# Altium schematic sheet SFP_uptoSFP28.SchDoc
size A3
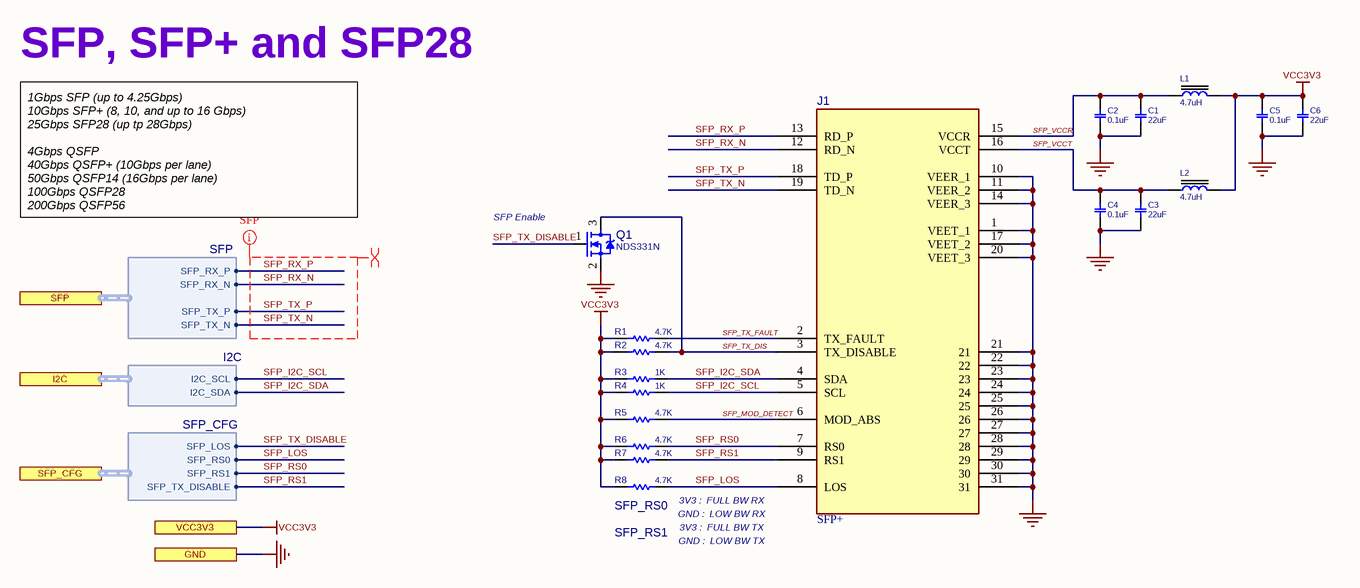
[diagram p0: SFP_uptoSFP28.SchDoc]

## Parts
C1  22uF  [C0603]
C2  0.1uF  [C0402]
C3  22uF  [C0603]
C4  0.1uF  [C0402]
C5  0.1uF  [C0402]
C6  22uF  [C0603]
J1  SFP+  [SFP_20_SH]
L1  4.7uH  [L_3]
L2  4.7uH  [L_3]
Q1  NDS331N  [SOT23_3]
R1  4.7K  [R0402]
R2  4.7K  [R0402]
R3  1K  [R0402]
R4  1K  [R0402]
R5  4.7K  [R0402]
R6  4.7K  [R0402]
R7  4.7K  [R0402]
R8  4.7K  [R0402]

## Ports
GND, I2C (harness I2C), SFP (harness SFP), SFP_CFG (harness SFP_CFG), VCC3V3

## Harnesses
SFP: SFP_RX_N, SFP_RX_P, SFP_TX_N, SFP_TX_P
I2C: I2C_SCL, I2C_SDA
SFP_CFG: SFP_LOS, SFP_RS0, SFP_RS1, SFP_TX_DISABLE

## Nets
GND: C1.2 C2.2 C3.2 C4.1 C5.1 C6.2 J1.1(VEET_1) J1.10(VEER_1) J1.11(VEER_2) J1.14(VEER_3) J1.17(VEET_2) J1.20(VEET_3) J1.21 J1.22 J1.23 J1.24 J1.25 J1.26 J1.27 J1.28 J1.29 J1.30 J1.31 Q1.2(SOURCE) ; port GND
VCC3V3: C5.2 C6.1 L1.2 L2.2 R1.2 R2.2 R3.1 R4.1 R5.2 R6.2 R7.2 R8.2 ; port VCC3V3
SFP_I2C_SCL: J1.5(SCL) R4.2 ; port I2C.I2C_SCL
SFP_I2C_SDA: J1.4(SDA) R3.2 ; port I2C.I2C_SDA
SFP_LOS: J1.8(LOS) R8.1 ; port SFP_CFG.SFP_RS0
SFP_MOD_DETECT: J1.6(MOD_ABS) R5.1
SFP_RS0: J1.7(RS0) R6.1 ; port SFP_CFG.SFP_RS1
SFP_RS1: J1.9(RS1) R7.1 ; port SFP_CFG.SFP_TX_DISABLE
SFP_RX_N: J1.12(RD_N) ; port SFP.SFP_RX_N
SFP_RX_P: J1.13(RD_P) ; port SFP.SFP_RX_P
SFP_TX_DIS: J1.3(TX_DISABLE) Q1.3(DRAIN) R2.1
SFP_TX_DISABLE: Q1.1(GATE) ; port SFP_CFG.SFP_LOS
SFP_TX_FAULT: J1.2(TX_FAULT) R1.1
SFP_TX_N: J1.19(TD_N) ; port SFP.SFP_TX_N
SFP_TX_P: J1.18(TD_P) ; port SFP.SFP_TX_P
SFP_VCCR: C1.1 C2.1 J1.15(VCCR) L1.1
SFP_VCCT: C3.1 C4.2 J1.16(VCCT) L2.1

## Layout directives
differential pair: SFP_RX_N, SFP_RX_P, SFP_TX_N, SFP_TX_P
net class SFP: SFP_RX_N, SFP_RX_P, SFP_TX_N, SFP_TX_P

## Notes on the sheet
- SFP, SFP+ and SFP28
- 1Gbps SFP (up to 4.25Gbps)
  10Gbps SFP+ (8, 10, and up to 16 Gbps)
  25Gbps SFP28 (up tp 28Gbps)
  4Gbps QSFP
  40Gbps QSFP+ (10Gbps per lane)
  50Gbps QSFP14 (16Gbps per lane)
  100Gbps QSFP28
  200Gbps QSFP56
- (near Q1) SFP Enable
- 3V3 :  FULL BW RX
- (near R8) SFP_RS0
- (near R8) SFP_RS1
- GND :  LOW BW RX
- GND :  LOW BW TX
- 3V3 :  FULL BW TX
- Title
- Size:
- Date:
- A3
- Number:
- Time:
- Revision:
- Sheet
- of
- File:

## Library data of the parts
C1 C3 C6 = CAP_SMD_MLCC_100u6.3VT: CAP, MLCC, X5R 22uF 20% 25V; MANF_P#: JMK325BJ107MM-T; MANF: Taiyo Yuden; PARAM: X5R, 20%, -55~85oC; PARAM2: 25v; PRICE: 100= 45$; VALUE: 22uF
C2 C4 C5 = CAP_SMD_MLCC_100n50T: CAP, MLCC, 100nF, 50V, X7R, 10%, 0402C; MANF: Taiyo Yuden; MANF_P#: UMK105B7104KVHF; PARAM: 50V; DESC: CAP, MLCC, 100nF, 50V, X7R, 10%, 0402C; PARAM2: X7R, 10%; ASSEMBLY: ASSEMBLY; PRICE: 100= 5$; VALUE: 0.1uF
J1 = CONN_SFP_20_SH: CONN, SFP PLUS (SFP+) RCPT 20POS R/A GOLD SMD; MANF: Molex; MANF_P#: 74441-0010; PARAM: optic fiber, SFP+; PRICE: 5.7$; VALUE: SFP+
L1 L2 = IND_SMD_2.2uH_2.9A: INDUCTOR; PARAM: 9.6A, 8.7A (Isat); MANF_P#: XAL4020-102MEC; MANF: Coilcraft; PARAM2: 14.6mOhm, -40~125oC; PRICE: 1.8$; ASSEMBLY: ASSEMBLY; VALUE: 4.7uH
Q1 = MOSN_NDS331N_SOT23: MOSFET N-CH 20V 1.3A 3-SSOT; DESC: DESCRIPTION; PARAM2: 460MW; MANF: Fairchild; PRICE: 0.072; PARAM: 20V; ASSEMBLY: ASSEMBLY; MANF_P#: NDS331N; VALUE: NDS331N
R1 R2 R5-R8 = RES_SMD_10K_0402: RESISTOR, SMD; MANF: Yageo; PARAM: 0.063W; DESC: DESCRIPTION; DIST#: MOUSER; PARAM2: 1%; MANF_P#: RC0402FR-074K7L; ASSEMBLY: ASSEMBLY; PRICE: 100= 0.3$; VALUE: 4.7K
R3 R4 = RES_SMD_0_0402: RESISTOR, SMD; MANF_P#: RK73Z1ETTP; MANF: KOA SPEER; PARAM: 0.063W; DESC: DESCRIPTION; DIST#: MOUSER; PARAM2: 1%; ASSEMBLY: ASSEMBLY; PRICE: 100= 0.8$; VALUE: 1K